# Altium schematic sheet GPS.SchDoc: SealHAT: GPS Subsystem
size Letter; DocumentNumber: 5; SheetNumber: 5; SheetTotal: 6
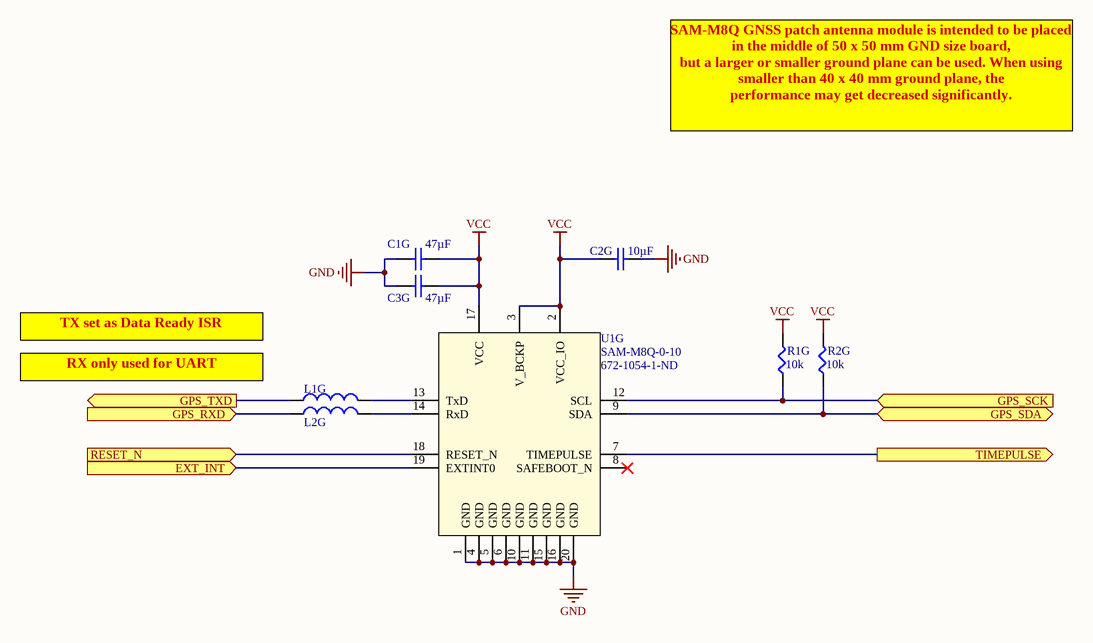
[diagram p0: GPS.SchDoc]

## Parts
C1G  Capacitance: 47µF  [C0805N]  (hidden comment: GRM21BR61A476ME15L)
C2G  Capacitance: 10µF  [C0603N]  (hidden comment: GRT188R61C106KE13D)
C3G  Capacitance: 47µF  [C0805N]  (hidden comment: GRM21BR61A476ME15L)
L1G  LI0603G221R-10  [R0603L]  (value not drawn)
L2G  LI0603G221R-10  [R0603L]  (value not drawn)
R1G  value 10k  [SMD-0603-RES]  (hidden comment: ERJ-3EKF1002V)
R2G  value 10k  [SMD-0603-RES]  (hidden comment: ERJ-3EKF1002V)
U1G  SAM-M8Q-0-10  Supplier Part Number 1: 672-1054-1-ND  [SAM-M8Q]

## Ports
EXT_INT (in), GPS_RXD (in), GPS_SCK (in), GPS_SDA (bidir), GPS_TXD (out), RESET_N (in), TIMEPULSE (out)

## Nets
GND: C1G.2 C2G.2 C3G.2 U1G.1(GND) U1G.4(GND) U1G.5(GND) U1G.6(GND) U1G.10(GND) U1G.11(GND) U1G.15(GND) U1G.16(GND) U1G.20(GND)
VCC: C1G.1 C2G.1 C3G.1 R1G.2 R2G.2 U1G.2(VCC_IO) U1G.3(V_BCKP) U1G.17(VCC)
EXT_INT: U1G.19(EXTINT0) ; port EXT_INT
GPS_RXD: L2G.1 ; port GPS_RXD
GPS_SCK: R1G.1 U1G.12(SCL) ; port GPS_SCK
GPS_SDA: R2G.1 U1G.9(SDA) ; port GPS_SDA
GPS_TXD: L1G.1 ; port GPS_TXD
RESET_N: U1G.18(RESET_N) ; port RESET_N
TIMEPULSE: U1G.7(TIMEPULSE) ; port TIMEPULSE
NetL1G_2: L1G.2 U1G.13(TxD)
NetL2G_2: L2G.2 U1G.14(RxD)

Not connected (* = marked no-connect by the designer): U1G 8(SAFEBOOT_N)*

## Notes on the sheet
- SAM‑M8Q GNSS patch antenna module is intended to be placed in the middle of 50 x 50 mm GND size board,
  but a larger or smaller ground plane can be used. When using smaller than 40 x 40 mm ground plane, the
  performance may get decreased significantly.
- TX set as Data Ready ISR
- RX only used for UART
- Title
- Size:
- Date:
- Letter
- Number:
- Time:
- Revision:
- Sheet
- of
- File:

## Library data of the parts
C1G C3G = CAPACITOR_NP: 47µF 10V Ceramic Capacitor X5R 0805; HOUSEPART: NO; POPULATE: 1; TOLERANCE: ±20%; VOLTAGE: 6.3V; DeviceName: GRM21BR61A476ME15L; LibraryName: MF_Passives; DeviceSetName: CAPACITOR_NP; MPN: GRM21BR61A476ME15L; URL: https://octopart.com/cl21a476mqclrnc-samsung-24871259; MF_PARTNUM: GRM21BR61A476ME15L; Temperature Coefficient: X5R; Supplier 1: Digi-Key; Supplier Part Number 1: 490-9961-1-ND
C2G = CAPACITOR_NP: 10µF 16V Ceramic Capacitor X5R 0603; HOUSEPART: NO; POPULATE: 1; TOLERANCE: ±10%; VOLTAGE: 10V; DeviceName: GRT188R61C106KE13D; LibraryName: MF_Passives; DeviceSetName: CAPACITOR_NP; MPN: GRT188R61C106KE13D; MF_PARTNUM: GRT188R61C106KE13D; Supplier 1: Digi-Key; Supplier Part Number 1: 490-12317-1-ND
L1G L2G = INDUCTOR: HOUSEPART: NO; POPULATE: 1; LibraryName: MF_Passives; DeviceSetName: INDUCTOR; MPN: LI0603G221R-10; URL: https://www.digikey.com/product-detail/en/laird-signal-integrity-products/LI0603G221R-10/240-2368-1-ND/806728; Supplier 1: Digi-Key; Supplier Part Number 1: 240-2368-1-ND
R1G R2G = ERJ-3EKF1002V: RES SMD 10K OHM 1% 1/10W 0603; Manufacturer: Panasonic Electronic Components; Factory Stock: 0; Unit Price (USD): 0.00379; @ qty: 1500; Minimum Quantity: 1; Power (Watts): 0.1W, 1/10W; Temperature Coefficient: ±100ppm/°C; Part Number: ERJ-3EKF1002V; Datasheets: http://industrial.panasonic.com/www-cgi/jvcr13pz.cgi?E+PZ+3+AOA0002+ERJ3EKF1002V+7+WW; Image: //media.digikey.com/Photos/Panasonic%20Photos/MFG_ERJ-P6W%20Series.jpg; Digi-Key Part Number: P10.0KHCT-ND; Quantity Available: 6703141; Packaging: Cut Tape (CT); Series: ERJ; Part Status: Active; Tolerance: ±1%; Composition: Thick Film; Features: Automotive AEC-Q200; Operating Temperature: -55°C ~ 155°C; Package / Case: 0603 (1608 Metric); Supplier Device Package: 0603; Size / Dimension: 0.063" L x 0.031" W (1.60mm x 0.80mm); Height - Seated (Max): 0.022" (0.55mm); Number of Terminations: 2; Failure Rate: -; Supplier 1: Digi-Key; Supplier Part Number 1: P10.0KHCT-ND
U1G = ublox-sam-m8Q: u-Blox M8 Gnss Antenna Module Tc; Octopart URL: https://octopart.com/sam-m8q-0-10-u-blox-88247750; Manufacturer Part Number: SAM-M8Q-0-10; OctopartID: 87e74baf2f475820; Case/Package: SAM-M8Q; Supplier 1: Digi-Key